# Altium schematic sheet top.SchDoc: Top level sheet
size A4; Date: 2023-02-10; DocumentNumber: 1; SheetNumber: 1; SheetTotal: 6
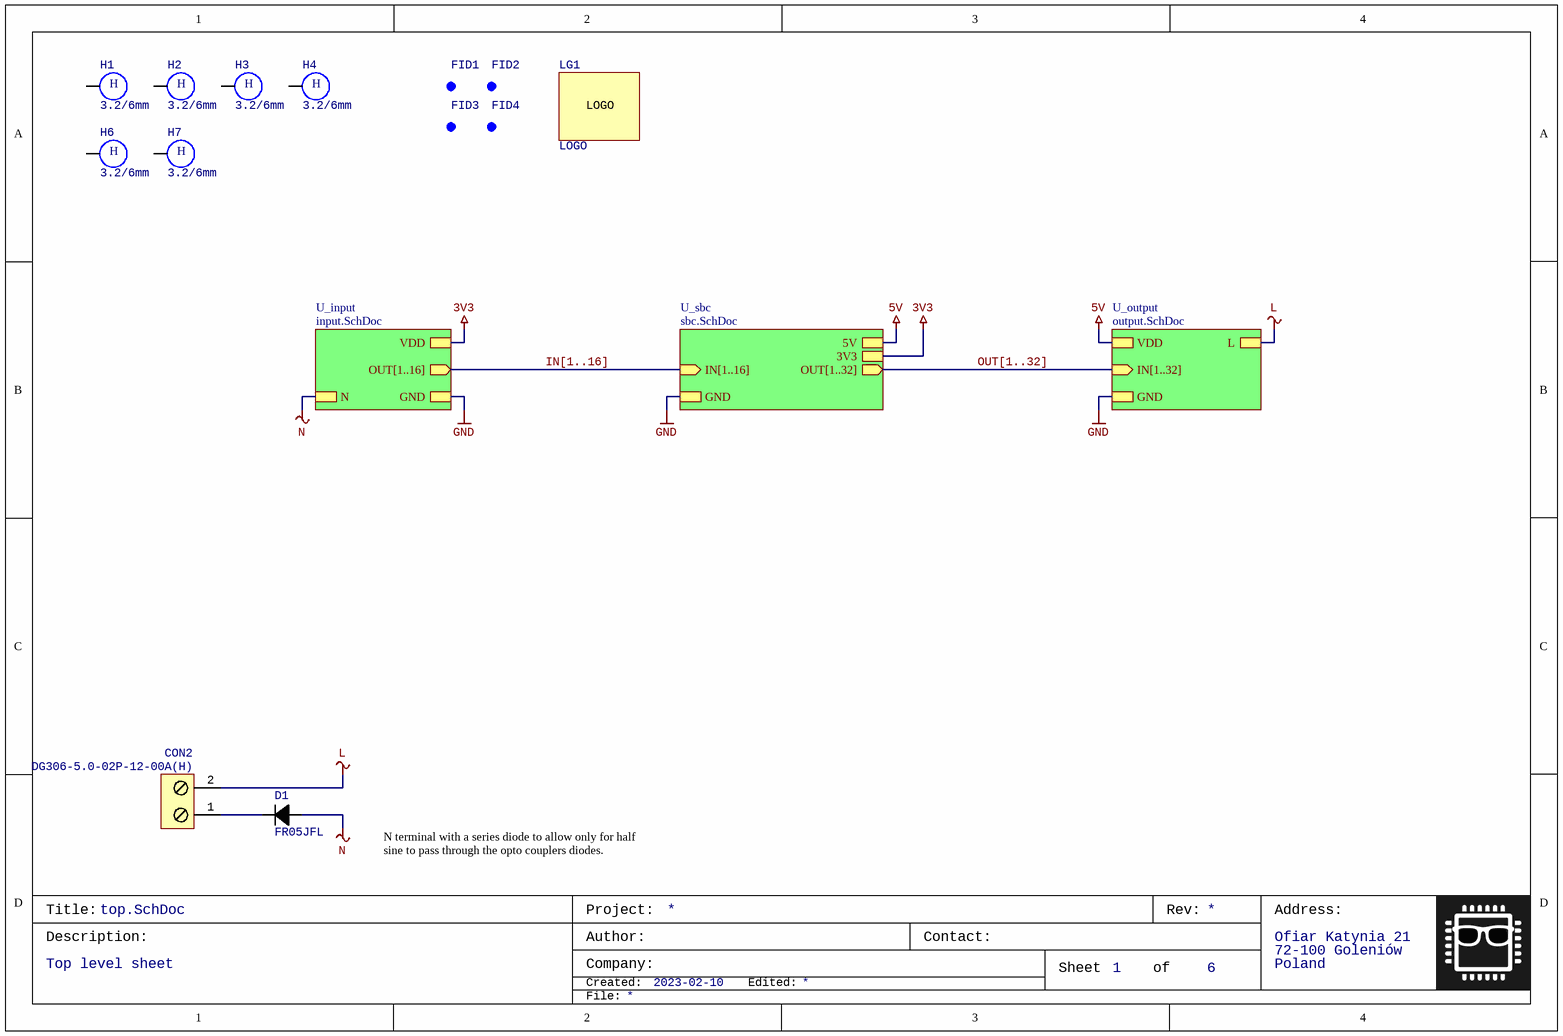
[diagram p0: top.SchDoc]

## Parts
CON2  DG306-5.0-02P-12-00A(H)  [Terminal-block-2way-5.0]
D1  FR05JFL  [SOD323]
FID1  Generic fidutial  [FID_ROUND]  (value not drawn)  (no BOM)
FID2  Generic fidutial  [FID_ROUND]  (value not drawn)  (no BOM)
FID3  Generic fidutial  [FID_ROUND]  (value not drawn)  (no BOM)
FID4  Generic fidutial  [FID_ROUND]  (value not drawn)  (no BOM)
H1  3.2/6mm  [hole-3.2/6]  (no BOM)
H2  3.2/6mm  [hole-3.2/6]  (no BOM)
H3  3.2/6mm  [hole-3.2/6]  (no BOM)
H4  3.2/6mm  [hole-3.2/6]  (no BOM)
H6  3.2/6mm  [hole-3.2/6]  (no BOM)
H7  3.2/6mm  [hole-3.2/6]  (no BOM)
LG1  LOGO  [LOGO_ENS]  (no BOM)

## Sub-sheets
U_input = input.SchDoc: OUT[1..16] (out), VDD, GND, N
U_output = output.SchDoc: L, VDD, GND, IN[1..32] (in)
U_sbc = sbc.SchDoc: 3V3, GND, 5V, IN[1..16] (in), OUT[1..32] (out)

## Nets
3V3: sheet U_input/VDD, sheet U_sbc/3V3
5V: sheet U_output/VDD, sheet U_sbc/5V
GND: sheet U_input/GND, sheet U_output/GND, sheet U_sbc/GND
L: CON2.2 ; sheet U_output/L
N: D1.2(A) ; sheet U_input/N
NetCON2_1: CON2.1 D1.1(K)

Not connected (* = marked no-connect by the designer): H1 1; H2 1; H3 1; H4 1; H6 1; H7 1

## Buses and harness runs
bus IN[1..16] = sheet U_input/OUT[1..16] = sheet U_sbc/IN[1..16]
bus OUT[1..32] = sheet U_output/IN[1..32] = sheet U_sbc/OUT[1..32]

## Notes on the sheet
- N terminal with a series diode to allow only for half sine to pass through the opto couplers diodes.
- Title:
- Project:
- Rev:
- Address:
- Description:
- Created:
- Author:
- Company:
- Edited:
- Contact:
- Sheet
- of
- Ofiar Katynia 21
- 72-100 Goleniów
- Poland
- File:
- (in symbol hole_metalized) H

## Library data of the parts
CON2 = Terminal Block 2: Screwed terminal block with 2 pins; Manufacturer: DEGSON ELECTRONICS; Identifier: DG306-5.0-02P-12-00A(H)
D1 = FR05xFL: FAST RECOVERY SURFACE MOUNT GLASS PASSIVATED RECTIFIER; Manufacturer: DC Components; V_R: 600V; I_F: 0.5A; V_F: 1.3V; Identifier: FR05JFL
FID1-FID4 = FID: Optical alignement fidutial PCB element (not visible in bom); Identifier: Generic fidutial
H1-H4 H6 H7 = hole_metalized: Generic hole component with 1 electrical connection; size: 3.2/6mm
LG1 = LOGO: Logo graphical object